# Altium schematic sheet 00-INDEX.SchDoc: Index
size A3; SheetNumber: 1; SheetTotal: 6
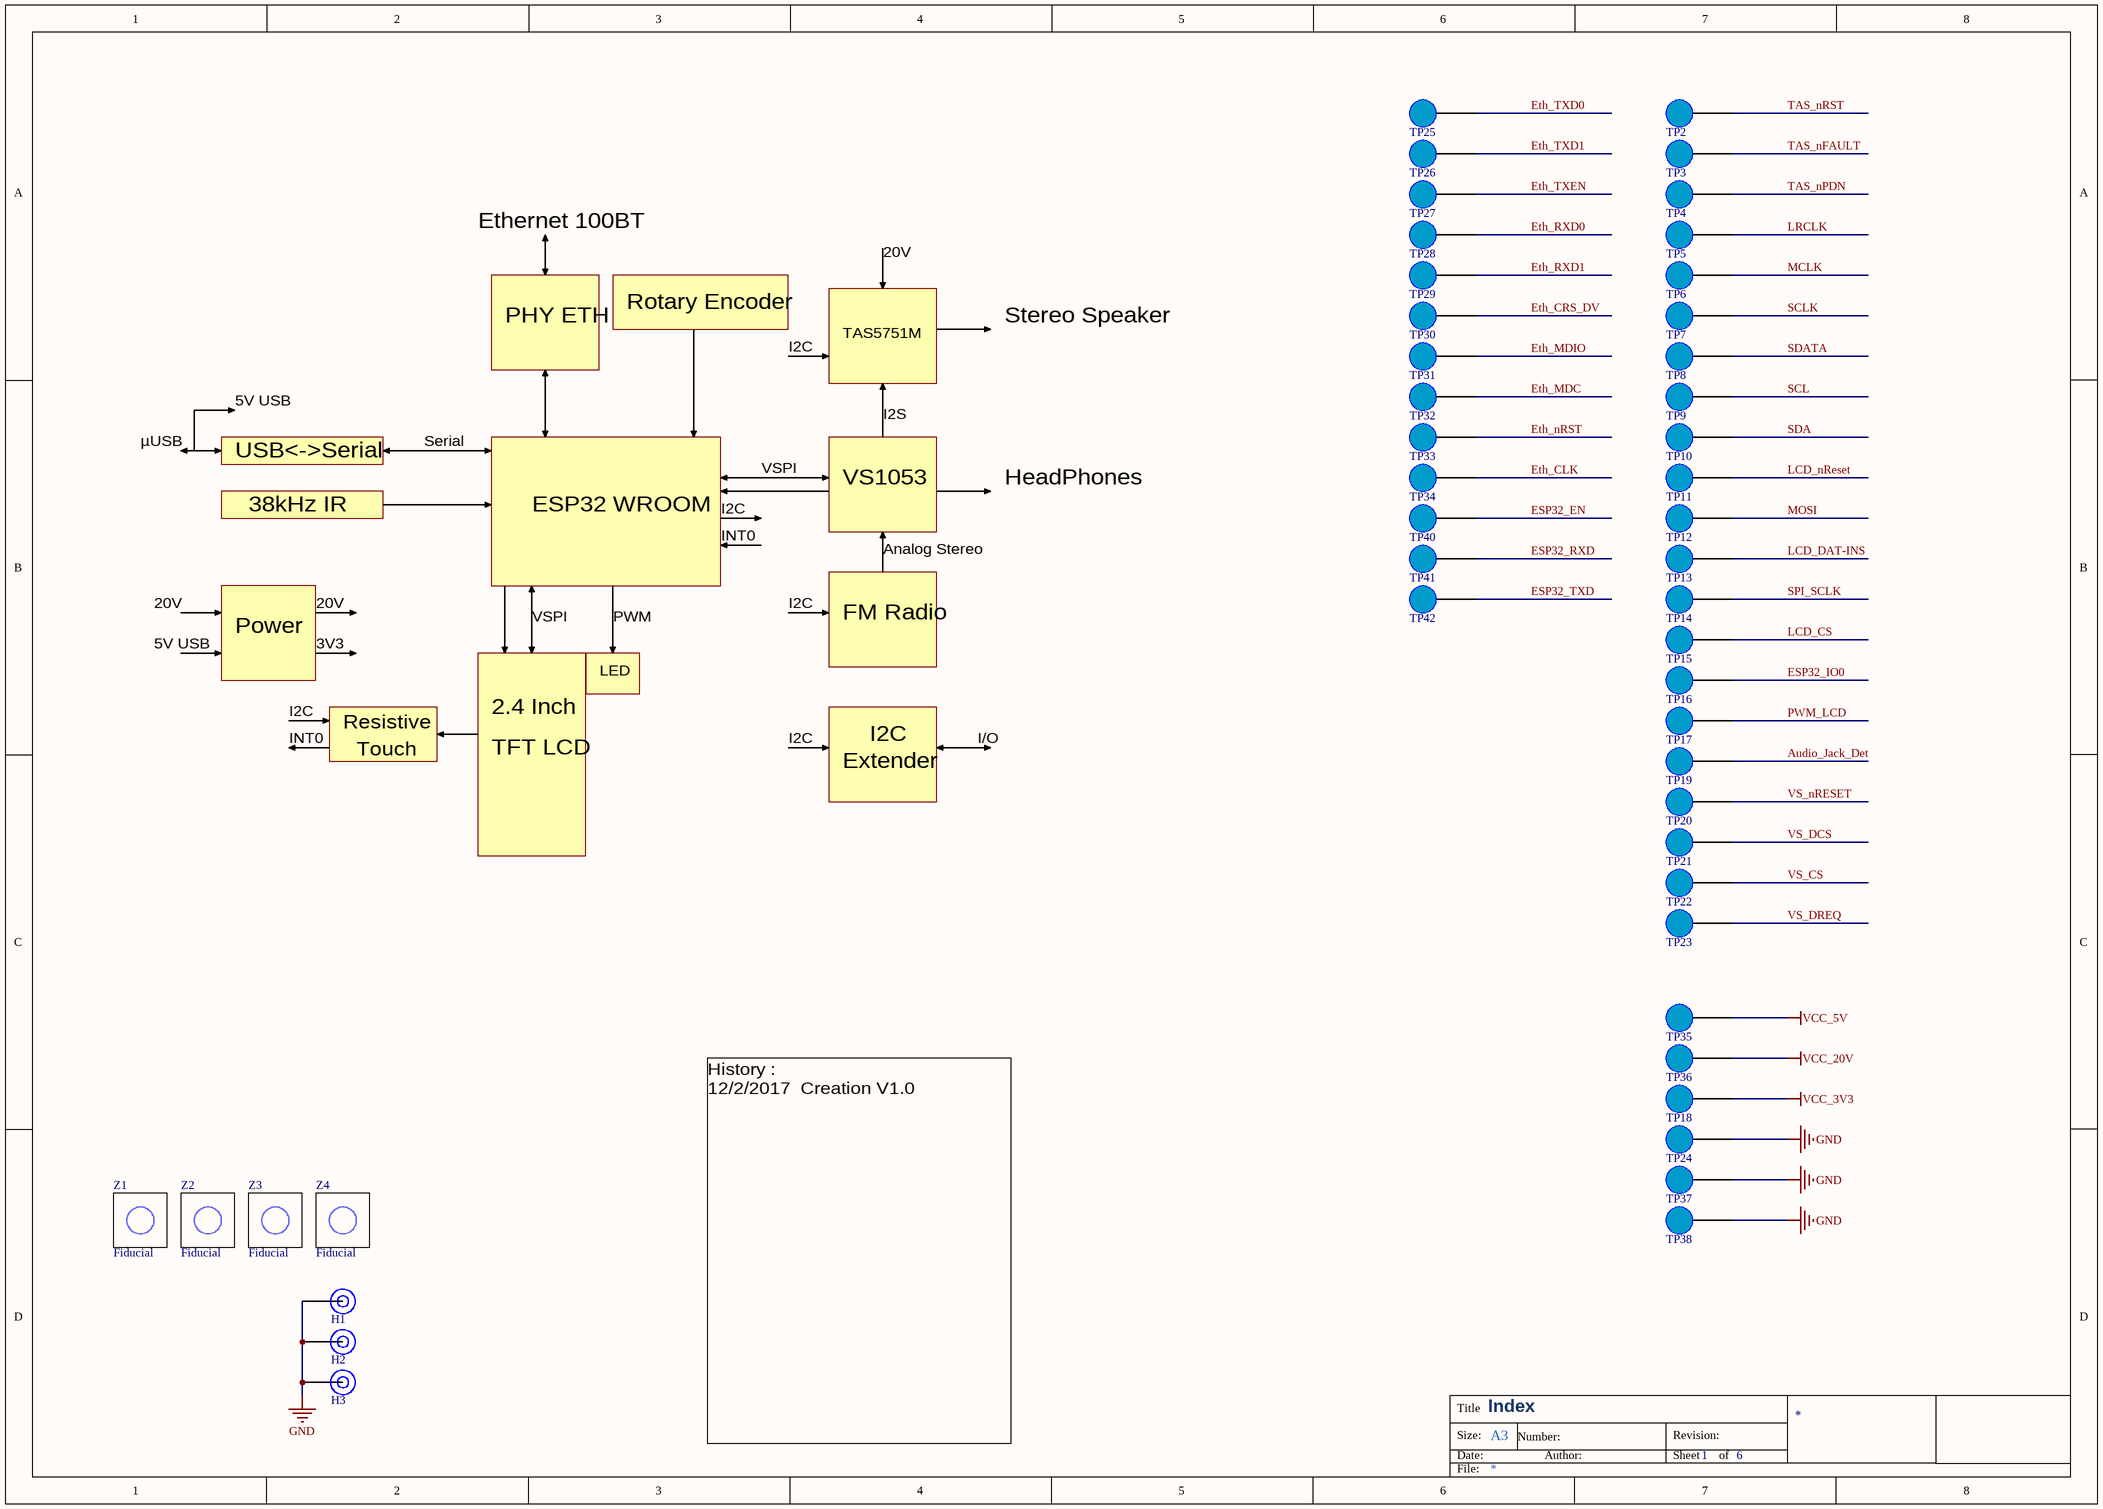
[diagram p0: 00-INDEX.SchDoc]

## Parts
H1  Hole_Screw_3mm  [Hole_3.2mm]  (value not drawn)  (no BOM)
H2  Hole_Screw_3mm  [Hole_3.2mm]  (value not drawn)  (no BOM)
H3  Hole_Screw_3mm  [Hole_3.2mm]  (value not drawn)  (no BOM)
TP2  TP_1mm  [TP_1mm]  (value not drawn)  (no BOM)
TP3  TP_1mm  [TP_1mm]  (value not drawn)  (no BOM)
TP4  TP_1mm  [TP_1mm]  (value not drawn)  (no BOM)
TP5  TP_1mm  [TP_1mm]  (value not drawn)  (no BOM)
TP6  TP_1mm  [TP_1mm]  (value not drawn)  (no BOM)
TP7  TP_1mm  [TP_1mm]  (value not drawn)  (no BOM)
TP8  TP_1mm  [TP_1mm]  (value not drawn)  (no BOM)
TP9  TP_1mm  [TP_1mm]  (value not drawn)  (no BOM)
TP10  TP_1mm  [TP_1mm]  (value not drawn)  (no BOM)
TP11  TP_1mm  [TP_1mm]  (value not drawn)  (no BOM)
TP12  TP_1mm  [TP_1mm]  (value not drawn)  (no BOM)
TP13  TP_1mm  [TP_1mm]  (value not drawn)  (no BOM)
TP14  TP_1mm  [TP_1mm]  (value not drawn)  (no BOM)
TP15  TP_1mm  [TP_1mm]  (value not drawn)  (no BOM)
TP16  TP_1mm  [TP_1mm]  (value not drawn)  (no BOM)
TP17  TP_1mm  [TP_1mm]  (value not drawn)  (no BOM)
TP18  TP_1mm  [TP_1mm]  (value not drawn)  (no BOM)
TP19  TP_1mm  [TP_1mm]  (value not drawn)  (no BOM)
TP20  TP_1mm  [TP_1mm]  (value not drawn)  (no BOM)
TP21  TP_1mm  [TP_1mm]  (value not drawn)  (no BOM)
TP22  TP_1mm  [TP_1mm]  (value not drawn)  (no BOM)
TP23  TP_1mm  [TP_1mm]  (value not drawn)  (no BOM)
TP24  TP_1mm  [TP_1mm]  (value not drawn)  (no BOM)
TP25  TP_1mm  [TP_1mm]  (value not drawn)  (no BOM)
TP26  TP_1mm  [TP_1mm]  (value not drawn)  (no BOM)
TP27  TP_1mm  [TP_1mm]  (value not drawn)  (no BOM)
TP28  TP_1mm  [TP_1mm]  (value not drawn)  (no BOM)
TP29  TP_1mm  [TP_1mm]  (value not drawn)  (no BOM)
TP30  TP_1mm  [TP_1mm]  (value not drawn)  (no BOM)
TP31  TP_1mm  [TP_1mm]  (value not drawn)  (no BOM)
TP32  TP_1mm  [TP_1mm]  (value not drawn)  (no BOM)
TP33  TP_1mm  [TP_1mm]  (value not drawn)  (no BOM)
TP34  TP_1mm  [TP_1mm]  (value not drawn)  (no BOM)
TP35  TP_1mm  [TP_1mm]  (value not drawn)  (no BOM)
TP36  TP_1mm  [TP_1mm]  (value not drawn)  (no BOM)
TP37  TP_1mm  [TP_1mm]  (value not drawn)  (no BOM)
TP38  TP_1mm  [TP_1mm]  (value not drawn)  (no BOM)
TP40  TP_1mm  [TP_1mm]  (value not drawn)  (no BOM)
TP41  TP_1mm  [TP_1mm]  (value not drawn)  (no BOM)
TP42  TP_1mm  [TP_1mm]  (value not drawn)  (no BOM)
Z1  Fiducial  [Fiducial_1mm]  (no BOM)
Z2  Fiducial  [Fiducial_1mm]  (no BOM)
Z3  Fiducial  [Fiducial_1mm]  (no BOM)
Z4  Fiducial  [Fiducial_1mm]  (no BOM)

## Nets
GND: H1.1 H2.1 H3.1 TP24.1 TP37.1 TP38.1
VCC_3V3: TP18.1
VCC_5V: TP35.1
VCC_20V: TP36.1
Audio_Jack_Det: TP19.1
ESP32_EN: TP40.1
ESP32_IO0: TP16.1
ESP32_RXD: TP41.1
ESP32_TXD: TP42.1
Eth_CLK: TP34.1
Eth_CRS_DV: TP30.1
Eth_MDC: TP32.1
Eth_MDIO: TP31.1
Eth_nRST: TP33.1
Eth_RXD0: TP28.1
Eth_RXD1: TP29.1
Eth_TXD0: TP25.1
Eth_TXD1: TP26.1
Eth_TXEN: TP27.1
LCD_CS: TP15.1
LCD_DAT-INS: TP13.1
LCD_nReset: TP11.1
LRCLK: TP5.1
MCLK: TP6.1
MOSI: TP12.1
PWM_LCD: TP17.1
SCL: TP9.1
SCLK: TP7.1
SDA: TP10.1
SDATA: TP8.1
SPI_SCLK: TP14.1
TAS_nFAULT: TP3.1
TAS_nPDN: TP4.1
TAS_nRST: TP2.1
VS_CS: TP22.1
VS_DCS: TP21.1
VS_DREQ: TP23.1
VS_nRESET: TP20.1

## Notes on the sheet
- Ethernet 100BT
- Rotary Encoder
- 20V
- PHY ETH
- I2C
- TAS5751M
- Stereo Speaker
- µUSB
- 5V USB
- Serial
- I2S
- USB<->Serial
- 38kHz IR
- ESP32 WROOM
- VSPI
- VS1053
- HeadPhones
- INT0
- Analog Stereo
- Power
- 3V3
- PWM
- FM Radio
- 2.4 Inch
- LED
- Resistive
- Touch
- TFT LCD
- Extender
- I/O
- History :
  12/2/2017  Creation V1.0
- Title
- Size:
- Date:
- A3
- Number:
- Author:
- Revision:
- Sheet
- of
- File:

## Library data of the parts
H1-H3 = Hole_Screw_3mm: Fix hole 3mm screw
TP2-TP38 TP40-TP42 = TP_1mm: Test point 1mm round SMD
Z1-Z4 = Fiducial: 1mm Fiducial